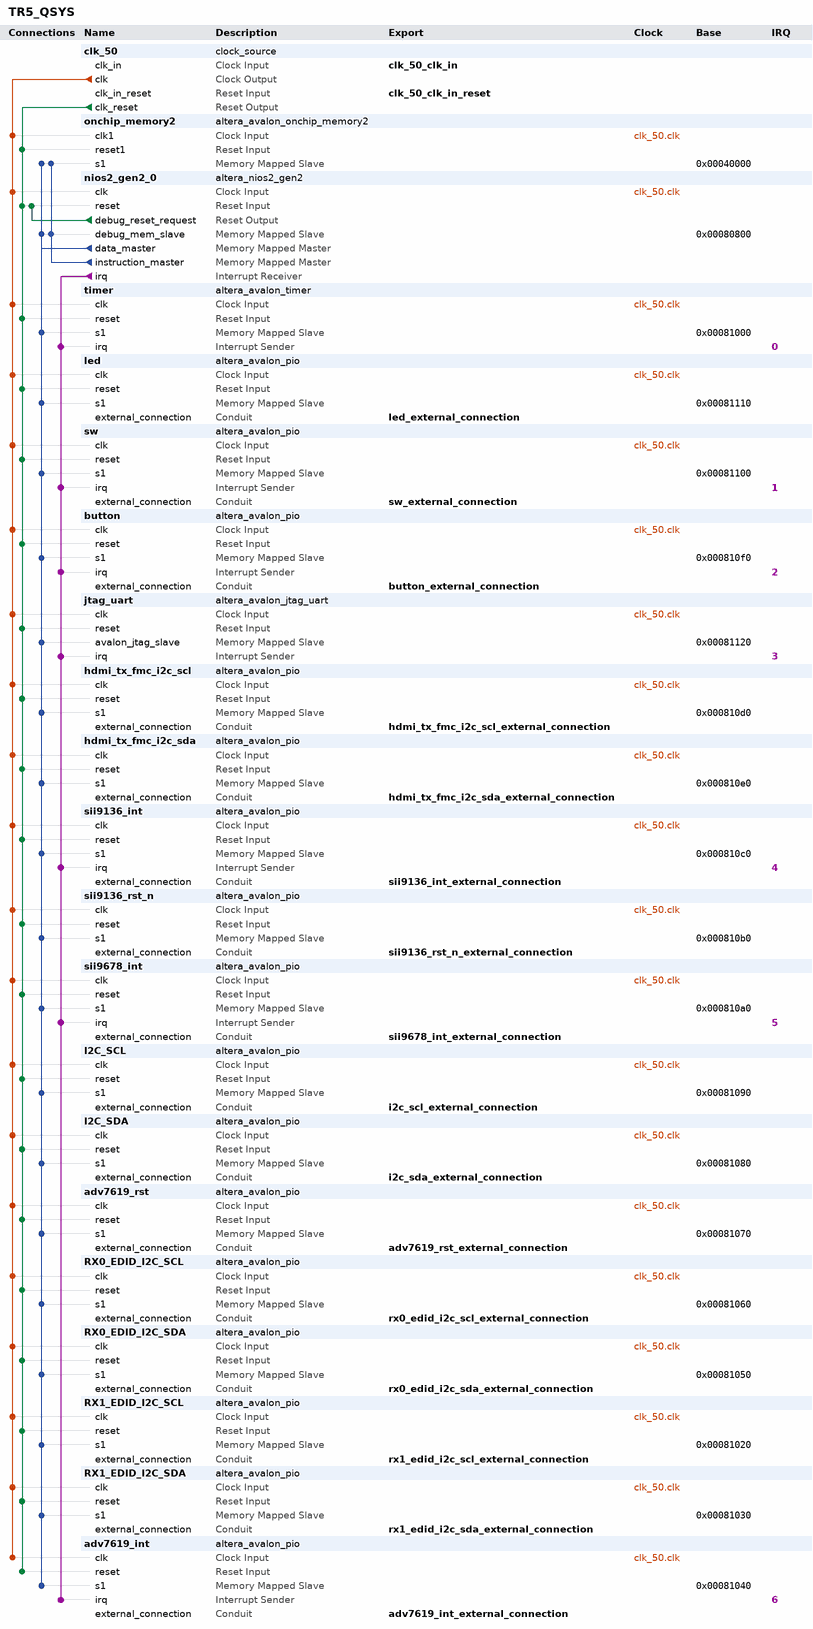
[diagram p0: system contents]
# Platform Designer (Qsys) system TR5_QSYS, Stratix V 5SGXEA7N2F45C2
# Parameters at their usual value, and those the tool derives, are not listed.
package require -exact qsys 16.1
create_system TR5_QSYS
set_project_property DEVICE_FAMILY {Stratix V}
set_project_property DEVICE 5SGXEA7N2F45C2

add_instance clk_50 clock_source 16.1
set_instance_parameter_value clk_50 clockFrequency 50000000

add_instance onchip_memory2 altera_avalon_onchip_memory2 16.1
set_instance_parameter_value onchip_memory2 dataWidth 32
set_instance_parameter_value onchip_memory2 dualPort false
set_instance_parameter_value onchip_memory2 initMemContent true
set_instance_parameter_value onchip_memory2 initializationFileName onchip_memory2
set_instance_parameter_value onchip_memory2 memorySize 256000

add_instance nios2_gen2_0 altera_nios2_gen2 16.1
set_instance_parameter_value nios2_gen2_0 dcache_size 2048
set_instance_parameter_value nios2_gen2_0 exceptionSlave onchip_memory2.s1
set_instance_parameter_value nios2_gen2_0 icache_size 4096
set_instance_parameter_value nios2_gen2_0 impl Fast
set_instance_parameter_value nios2_gen2_0 resetSlave onchip_memory2.s1

add_instance timer altera_avalon_timer 16.1
set_instance_parameter_value timer period 1
set_instance_parameter_value timer periodUnits MSEC

add_instance led altera_avalon_pio 16.1
set_instance_parameter_value led direction Output
set_instance_parameter_value led width 4

add_instance sw altera_avalon_pio 16.1
set_instance_parameter_value sw captureEdge true
set_instance_parameter_value sw direction Input
set_instance_parameter_value sw edgeType ANY
set_instance_parameter_value sw generateIRQ true
set_instance_parameter_value sw irqType EDGE
set_instance_parameter_value sw width 4

add_instance button altera_avalon_pio 16.1
set_instance_parameter_value button captureEdge true
set_instance_parameter_value button direction Input
set_instance_parameter_value button edgeType FALLING
set_instance_parameter_value button generateIRQ true
set_instance_parameter_value button irqType EDGE
set_instance_parameter_value button width 4

add_instance jtag_uart altera_avalon_jtag_uart 16.1
set_instance_parameter_value jtag_uart simInteractiveOptions INTERACTIVE_ASCII_OUTPUT

add_instance hdmi_tx_fmc_i2c_scl altera_avalon_pio 16.1
set_instance_parameter_value hdmi_tx_fmc_i2c_scl direction Output
set_instance_parameter_value hdmi_tx_fmc_i2c_scl width 1

add_instance hdmi_tx_fmc_i2c_sda altera_avalon_pio 16.1
set_instance_parameter_value hdmi_tx_fmc_i2c_sda direction Bidir
set_instance_parameter_value hdmi_tx_fmc_i2c_sda width 1

add_instance sii9136_int altera_avalon_pio 16.1
set_instance_parameter_value sii9136_int captureEdge true
set_instance_parameter_value sii9136_int direction Input
set_instance_parameter_value sii9136_int edgeType FALLING
set_instance_parameter_value sii9136_int generateIRQ true
set_instance_parameter_value sii9136_int irqType EDGE
set_instance_parameter_value sii9136_int width 1

add_instance sii9136_rst_n altera_avalon_pio 16.1
set_instance_parameter_value sii9136_rst_n direction Output
set_instance_parameter_value sii9136_rst_n width 1

add_instance sii9678_int altera_avalon_pio 16.1
set_instance_parameter_value sii9678_int captureEdge true
set_instance_parameter_value sii9678_int direction Input
set_instance_parameter_value sii9678_int generateIRQ true
set_instance_parameter_value sii9678_int irqType EDGE
set_instance_parameter_value sii9678_int width 1

add_instance I2C_SCL altera_avalon_pio 16.1
set_instance_parameter_value I2C_SCL direction Output
set_instance_parameter_value I2C_SCL width 1

add_instance I2C_SDA altera_avalon_pio 16.1
set_instance_parameter_value I2C_SDA direction Bidir
set_instance_parameter_value I2C_SDA width 1

add_instance adv7619_rst altera_avalon_pio 16.1
set_instance_parameter_value adv7619_rst direction Output
set_instance_parameter_value adv7619_rst width 1

add_instance RX0_EDID_I2C_SCL altera_avalon_pio 16.1
set_instance_parameter_value RX0_EDID_I2C_SCL direction Output
set_instance_parameter_value RX0_EDID_I2C_SCL width 1

add_instance RX0_EDID_I2C_SDA altera_avalon_pio 16.1
set_instance_parameter_value RX0_EDID_I2C_SDA direction Bidir
set_instance_parameter_value RX0_EDID_I2C_SDA width 1

add_instance RX1_EDID_I2C_SCL altera_avalon_pio 16.1
set_instance_parameter_value RX1_EDID_I2C_SCL direction Output
set_instance_parameter_value RX1_EDID_I2C_SCL width 1

add_instance RX1_EDID_I2C_SDA altera_avalon_pio 16.1
set_instance_parameter_value RX1_EDID_I2C_SDA direction Bidir
set_instance_parameter_value RX1_EDID_I2C_SDA width 1

add_instance adv7619_int altera_avalon_pio 16.1
set_instance_parameter_value adv7619_int captureEdge true
set_instance_parameter_value adv7619_int direction Input
set_instance_parameter_value adv7619_int edgeType FALLING
set_instance_parameter_value adv7619_int generateIRQ true
set_instance_parameter_value adv7619_int irqType EDGE
set_instance_parameter_value adv7619_int width 1

# connections
add_connection clk_50.clk adv7619_int.clk clock
add_connection clk_50.clk adv7619_rst.clk clock
add_connection clk_50.clk button.clk clock
add_connection clk_50.clk hdmi_tx_fmc_i2c_scl.clk clock
add_connection clk_50.clk hdmi_tx_fmc_i2c_sda.clk clock
add_connection clk_50.clk I2C_SCL.clk clock
add_connection clk_50.clk I2C_SDA.clk clock
add_connection clk_50.clk jtag_uart.clk clock
add_connection clk_50.clk led.clk clock
add_connection clk_50.clk nios2_gen2_0.clk clock
add_connection clk_50.clk onchip_memory2.clk1 clock
add_connection clk_50.clk RX0_EDID_I2C_SCL.clk clock
add_connection clk_50.clk RX0_EDID_I2C_SDA.clk clock
add_connection clk_50.clk RX1_EDID_I2C_SCL.clk clock
add_connection clk_50.clk RX1_EDID_I2C_SDA.clk clock
add_connection clk_50.clk sii9136_int.clk clock
add_connection clk_50.clk sii9136_rst_n.clk clock
add_connection clk_50.clk sii9678_int.clk clock
add_connection clk_50.clk sw.clk clock
add_connection clk_50.clk timer.clk clock
add_connection clk_50.clk_reset adv7619_int.reset reset
add_connection clk_50.clk_reset adv7619_rst.reset reset
add_connection clk_50.clk_reset button.reset reset
add_connection clk_50.clk_reset hdmi_tx_fmc_i2c_scl.reset reset
add_connection clk_50.clk_reset hdmi_tx_fmc_i2c_sda.reset reset
add_connection clk_50.clk_reset I2C_SCL.reset reset
add_connection clk_50.clk_reset I2C_SDA.reset reset
add_connection clk_50.clk_reset jtag_uart.reset reset
add_connection clk_50.clk_reset led.reset reset
add_connection clk_50.clk_reset nios2_gen2_0.reset reset
add_connection clk_50.clk_reset onchip_memory2.reset1 reset
add_connection clk_50.clk_reset RX0_EDID_I2C_SCL.reset reset
add_connection clk_50.clk_reset RX0_EDID_I2C_SDA.reset reset
add_connection clk_50.clk_reset RX1_EDID_I2C_SCL.reset reset
add_connection clk_50.clk_reset RX1_EDID_I2C_SDA.reset reset
add_connection clk_50.clk_reset sii9136_int.reset reset
add_connection clk_50.clk_reset sii9136_rst_n.reset reset
add_connection clk_50.clk_reset sii9678_int.reset reset
add_connection clk_50.clk_reset sw.reset reset
add_connection clk_50.clk_reset timer.reset reset
add_connection nios2_gen2_0.debug_reset_request nios2_gen2_0.reset reset
add_connection nios2_gen2_0.data_master adv7619_int.s1 avalon
set_connection_parameter_value nios2_gen2_0.data_master/adv7619_int.s1 baseAddress 0x00081040
add_connection nios2_gen2_0.data_master adv7619_rst.s1 avalon
set_connection_parameter_value nios2_gen2_0.data_master/adv7619_rst.s1 baseAddress 0x00081070
add_connection nios2_gen2_0.data_master button.s1 avalon
set_connection_parameter_value nios2_gen2_0.data_master/button.s1 baseAddress 0x000810f0
add_connection nios2_gen2_0.data_master hdmi_tx_fmc_i2c_scl.s1 avalon
set_connection_parameter_value nios2_gen2_0.data_master/hdmi_tx_fmc_i2c_scl.s1 baseAddress 0x000810d0
add_connection nios2_gen2_0.data_master hdmi_tx_fmc_i2c_sda.s1 avalon
set_connection_parameter_value nios2_gen2_0.data_master/hdmi_tx_fmc_i2c_sda.s1 baseAddress 0x000810e0
add_connection nios2_gen2_0.data_master I2C_SCL.s1 avalon
set_connection_parameter_value nios2_gen2_0.data_master/I2C_SCL.s1 baseAddress 0x00081090
add_connection nios2_gen2_0.data_master I2C_SDA.s1 avalon
set_connection_parameter_value nios2_gen2_0.data_master/I2C_SDA.s1 baseAddress 0x00081080
add_connection nios2_gen2_0.data_master jtag_uart.avalon_jtag_slave avalon
set_connection_parameter_value nios2_gen2_0.data_master/jtag_uart.avalon_jtag_slave baseAddress 0x00081120
add_connection nios2_gen2_0.data_master led.s1 avalon
set_connection_parameter_value nios2_gen2_0.data_master/led.s1 baseAddress 0x00081110
add_connection nios2_gen2_0.data_master nios2_gen2_0.debug_mem_slave avalon
set_connection_parameter_value nios2_gen2_0.data_master/nios2_gen2_0.debug_mem_slave baseAddress 0x00080800
add_connection nios2_gen2_0.data_master onchip_memory2.s1 avalon
set_connection_parameter_value nios2_gen2_0.data_master/onchip_memory2.s1 baseAddress 0x00040000
add_connection nios2_gen2_0.data_master RX0_EDID_I2C_SCL.s1 avalon
set_connection_parameter_value nios2_gen2_0.data_master/RX0_EDID_I2C_SCL.s1 baseAddress 0x00081060
add_connection nios2_gen2_0.data_master RX0_EDID_I2C_SDA.s1 avalon
set_connection_parameter_value nios2_gen2_0.data_master/RX0_EDID_I2C_SDA.s1 baseAddress 0x00081050
add_connection nios2_gen2_0.data_master RX1_EDID_I2C_SCL.s1 avalon
set_connection_parameter_value nios2_gen2_0.data_master/RX1_EDID_I2C_SCL.s1 baseAddress 0x00081020
add_connection nios2_gen2_0.data_master RX1_EDID_I2C_SDA.s1 avalon
set_connection_parameter_value nios2_gen2_0.data_master/RX1_EDID_I2C_SDA.s1 baseAddress 0x00081030
add_connection nios2_gen2_0.data_master sii9136_int.s1 avalon
set_connection_parameter_value nios2_gen2_0.data_master/sii9136_int.s1 baseAddress 0x000810c0
add_connection nios2_gen2_0.data_master sii9136_rst_n.s1 avalon
set_connection_parameter_value nios2_gen2_0.data_master/sii9136_rst_n.s1 baseAddress 0x000810b0
add_connection nios2_gen2_0.data_master sii9678_int.s1 avalon
set_connection_parameter_value nios2_gen2_0.data_master/sii9678_int.s1 baseAddress 0x000810a0
add_connection nios2_gen2_0.data_master sw.s1 avalon
set_connection_parameter_value nios2_gen2_0.data_master/sw.s1 baseAddress 0x00081100
add_connection nios2_gen2_0.data_master timer.s1 avalon
set_connection_parameter_value nios2_gen2_0.data_master/timer.s1 baseAddress 0x00081000
add_connection nios2_gen2_0.instruction_master nios2_gen2_0.debug_mem_slave avalon
set_connection_parameter_value nios2_gen2_0.instruction_master/nios2_gen2_0.debug_mem_slave baseAddress 0x00080800
add_connection nios2_gen2_0.instruction_master onchip_memory2.s1 avalon
set_connection_parameter_value nios2_gen2_0.instruction_master/onchip_memory2.s1 baseAddress 0x00040000
add_connection nios2_gen2_0.irq adv7619_int.irq interrupt
set_connection_parameter_value nios2_gen2_0.irq/adv7619_int.irq irqNumber 6
add_connection nios2_gen2_0.irq button.irq interrupt
set_connection_parameter_value nios2_gen2_0.irq/button.irq irqNumber 2
add_connection nios2_gen2_0.irq jtag_uart.irq interrupt
set_connection_parameter_value nios2_gen2_0.irq/jtag_uart.irq irqNumber 3
add_connection nios2_gen2_0.irq sii9136_int.irq interrupt
set_connection_parameter_value nios2_gen2_0.irq/sii9136_int.irq irqNumber 4
add_connection nios2_gen2_0.irq sii9678_int.irq interrupt
set_connection_parameter_value nios2_gen2_0.irq/sii9678_int.irq irqNumber 5
add_connection nios2_gen2_0.irq sw.irq interrupt
set_connection_parameter_value nios2_gen2_0.irq/sw.irq irqNumber 1
add_connection nios2_gen2_0.irq timer.irq interrupt
set_connection_parameter_value nios2_gen2_0.irq/timer.irq irqNumber 0

# exported interfaces
add_interface adv7619_int_external_connection conduit end
set_interface_property adv7619_int_external_connection EXPORT_OF adv7619_int.external_connection
add_interface adv7619_rst_external_connection conduit end
set_interface_property adv7619_rst_external_connection EXPORT_OF adv7619_rst.external_connection
add_interface button_external_connection conduit end
set_interface_property button_external_connection EXPORT_OF button.external_connection
add_interface clk_50_clk_in clock sink
set_interface_property clk_50_clk_in EXPORT_OF clk_50.clk_in
add_interface clk_50_clk_in_reset reset sink
set_interface_property clk_50_clk_in_reset EXPORT_OF clk_50.clk_in_reset
add_interface hdmi_tx_fmc_i2c_scl_external_connection conduit end
set_interface_property hdmi_tx_fmc_i2c_scl_external_connection EXPORT_OF hdmi_tx_fmc_i2c_scl.external_connection
add_interface hdmi_tx_fmc_i2c_sda_external_connection conduit end
set_interface_property hdmi_tx_fmc_i2c_sda_external_connection EXPORT_OF hdmi_tx_fmc_i2c_sda.external_connection
add_interface i2c_scl_external_connection conduit end
set_interface_property i2c_scl_external_connection EXPORT_OF I2C_SCL.external_connection
add_interface i2c_sda_external_connection conduit end
set_interface_property i2c_sda_external_connection EXPORT_OF I2C_SDA.external_connection
add_interface led_external_connection conduit end
set_interface_property led_external_connection EXPORT_OF led.external_connection
add_interface rx0_edid_i2c_scl_external_connection conduit end
set_interface_property rx0_edid_i2c_scl_external_connection EXPORT_OF RX0_EDID_I2C_SCL.external_connection
add_interface rx0_edid_i2c_sda_external_connection conduit end
set_interface_property rx0_edid_i2c_sda_external_connection EXPORT_OF RX0_EDID_I2C_SDA.external_connection
add_interface rx1_edid_i2c_scl_external_connection conduit end
set_interface_property rx1_edid_i2c_scl_external_connection EXPORT_OF RX1_EDID_I2C_SCL.external_connection
add_interface rx1_edid_i2c_sda_external_connection conduit end
set_interface_property rx1_edid_i2c_sda_external_connection EXPORT_OF RX1_EDID_I2C_SDA.external_connection
add_interface sii9136_int_external_connection conduit end
set_interface_property sii9136_int_external_connection EXPORT_OF sii9136_int.external_connection
add_interface sii9136_rst_n_external_connection conduit end
set_interface_property sii9136_rst_n_external_connection EXPORT_OF sii9136_rst_n.external_connection
add_interface sii9678_int_external_connection conduit end
set_interface_property sii9678_int_external_connection EXPORT_OF sii9678_int.external_connection
add_interface sw_external_connection conduit end
set_interface_property sw_external_connection EXPORT_OF sw.external_connection

set_interconnect_requirement {$system} qsys_mm.clockCrossingAdapter HANDSHAKE
set_interconnect_requirement {$system} qsys_mm.maxAdditionalLatency 1

save_system TR5_QSYS.qsys
